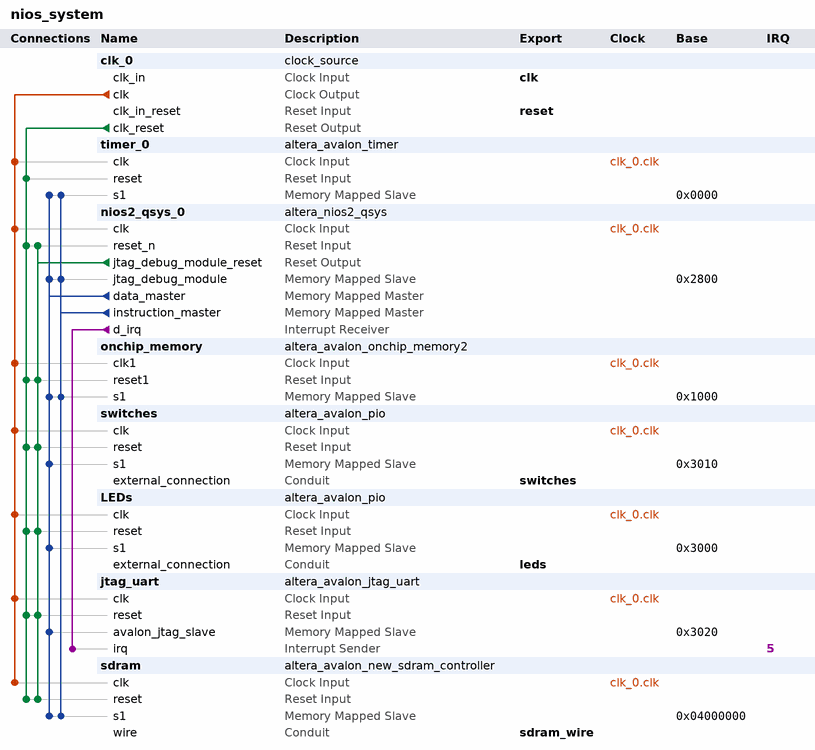
[diagram p0: system contents]
# Platform Designer (Qsys) system nios_system, Cyclone IV E EP4CE22F17C6
# Parameters at their usual value, and those the tool derives, are not listed.
package require -exact qsys 13.0.1.99.2
create_system nios_system
set_project_property DEVICE_FAMILY {Cyclone IV E}
set_project_property DEVICE EP4CE22F17C6

add_instance clk_0 clock_source 13.0
set_instance_parameter_value clk_0 clockFrequency 50000000

add_instance timer_0 altera_avalon_timer 13.0.1.99.2
set_instance_parameter_value timer_0 period 1
set_instance_parameter_value timer_0 periodUnits MSEC

add_instance nios2_qsys_0 altera_nios2_qsys 13.0
set_instance_parameter_value nios2_qsys_0 resetSlave sdram.s1
set_instance_parameter_value nios2_qsys_0 mmu_TLBMissExcSlave None
set_instance_parameter_value nios2_qsys_0 exceptionSlave sdram.s1
set_instance_parameter_value nios2_qsys_0 breakSlave nios2_qsys_0.jtag_debug_module
set_instance_parameter_value nios2_qsys_0 impl Tiny
set_instance_parameter_value nios2_qsys_0 icache_size 4096

add_instance onchip_memory altera_avalon_onchip_memory2 13.0.1.99.2
set_instance_parameter_value onchip_memory dataWidth 32
set_instance_parameter_value onchip_memory dualPort false
set_instance_parameter_value onchip_memory initMemContent true
set_instance_parameter_value onchip_memory initializationFileName onchip_mem.hex
set_instance_parameter_value onchip_memory memorySize 4096

add_instance switches altera_avalon_pio 13.0.1.99.2
set_instance_parameter_value switches direction Input
set_instance_parameter_value switches width 8

add_instance LEDs altera_avalon_pio 13.0.1.99.2
set_instance_parameter_value LEDs direction Output
set_instance_parameter_value LEDs width 8

add_instance jtag_uart altera_avalon_jtag_uart 13.0.1.99.2
set_instance_parameter_value jtag_uart simInteractiveOptions NO_INTERACTIVE_WINDOWS

add_instance sdram altera_avalon_new_sdram_controller 13.0.1.99.2
set_instance_parameter_value sdram TAC 5.5
set_instance_parameter_value sdram TRCD 20.0
set_instance_parameter_value sdram TRP 20.0
set_instance_parameter_value sdram casLatency 3
set_instance_parameter_value sdram columnWidth 9
set_instance_parameter_value sdram dataWidth 16
set_instance_parameter_value sdram generateSimulationModel false
set_instance_parameter_value sdram model single_Micron_MT48LC4M32B2_7_chip
set_instance_parameter_value sdram numberOfBanks 4
set_instance_parameter_value sdram numberOfChipSelects 1
set_instance_parameter_value sdram powerUpDelay 100.0
set_instance_parameter_value sdram refreshPeriod 15.625
set_instance_parameter_value sdram rowWidth 13

# connections
add_connection clk_0.clk jtag_uart.clk clock
add_connection clk_0.clk LEDs.clk clock
add_connection clk_0.clk nios2_qsys_0.clk clock
add_connection clk_0.clk onchip_memory.clk1 clock
add_connection clk_0.clk sdram.clk clock
add_connection clk_0.clk switches.clk clock
add_connection clk_0.clk timer_0.clk clock
add_connection clk_0.clk_reset jtag_uart.reset reset
add_connection clk_0.clk_reset LEDs.reset reset
add_connection clk_0.clk_reset nios2_qsys_0.reset_n reset
add_connection clk_0.clk_reset onchip_memory.reset1 reset
add_connection clk_0.clk_reset sdram.reset reset
add_connection clk_0.clk_reset switches.reset reset
add_connection clk_0.clk_reset timer_0.reset reset
add_connection nios2_qsys_0.jtag_debug_module_reset jtag_uart.reset reset
add_connection nios2_qsys_0.jtag_debug_module_reset LEDs.reset reset
add_connection nios2_qsys_0.jtag_debug_module_reset nios2_qsys_0.reset_n reset
add_connection nios2_qsys_0.jtag_debug_module_reset onchip_memory.reset1 reset
add_connection nios2_qsys_0.jtag_debug_module_reset sdram.reset reset
add_connection nios2_qsys_0.jtag_debug_module_reset switches.reset reset
add_connection nios2_qsys_0.data_master jtag_uart.avalon_jtag_slave avalon
set_connection_parameter_value nios2_qsys_0.data_master/jtag_uart.avalon_jtag_slave baseAddress 0x3020
add_connection nios2_qsys_0.data_master LEDs.s1 avalon
set_connection_parameter_value nios2_qsys_0.data_master/LEDs.s1 baseAddress 0x3000
add_connection nios2_qsys_0.data_master nios2_qsys_0.jtag_debug_module avalon
set_connection_parameter_value nios2_qsys_0.data_master/nios2_qsys_0.jtag_debug_module baseAddress 0x2800
add_connection nios2_qsys_0.data_master onchip_memory.s1 avalon
set_connection_parameter_value nios2_qsys_0.data_master/onchip_memory.s1 baseAddress 0x1000
add_connection nios2_qsys_0.data_master sdram.s1 avalon
set_connection_parameter_value nios2_qsys_0.data_master/sdram.s1 baseAddress 0x04000000
add_connection nios2_qsys_0.data_master switches.s1 avalon
set_connection_parameter_value nios2_qsys_0.data_master/switches.s1 baseAddress 0x3010
add_connection nios2_qsys_0.data_master timer_0.s1 avalon
set_connection_parameter_value nios2_qsys_0.data_master/timer_0.s1 baseAddress 0x0000
add_connection nios2_qsys_0.instruction_master nios2_qsys_0.jtag_debug_module avalon
set_connection_parameter_value nios2_qsys_0.instruction_master/nios2_qsys_0.jtag_debug_module baseAddress 0x2800
add_connection nios2_qsys_0.instruction_master onchip_memory.s1 avalon
set_connection_parameter_value nios2_qsys_0.instruction_master/onchip_memory.s1 baseAddress 0x1000
add_connection nios2_qsys_0.instruction_master sdram.s1 avalon
set_connection_parameter_value nios2_qsys_0.instruction_master/sdram.s1 baseAddress 0x04000000
add_connection nios2_qsys_0.instruction_master timer_0.s1 avalon
set_connection_parameter_value nios2_qsys_0.instruction_master/timer_0.s1 baseAddress 0x0000
add_connection nios2_qsys_0.d_irq jtag_uart.irq interrupt
set_connection_parameter_value nios2_qsys_0.d_irq/jtag_uart.irq irqNumber 5

# exported interfaces
add_interface reset reset sink
set_interface_property reset EXPORT_OF clk_0.clk_in_reset
add_interface switches conduit end
set_interface_property switches EXPORT_OF switches.external_connection
add_interface leds conduit end
set_interface_property leds EXPORT_OF LEDs.external_connection
add_interface clk clock sink
set_interface_property clk EXPORT_OF clk_0.clk_in
add_interface sdram_wire conduit end
set_interface_property sdram_wire EXPORT_OF sdram.wire

set_interconnect_requirement {$system} qsys_mm.clockCrossingAdapter HANDSHAKE
set_interconnect_requirement {$system} qsys_mm.maxAdditionalLatency 1

save_system nios_system.qsys
